# EAGLE design Rotary Encoder Breakout (EAGLE 7.7.0)
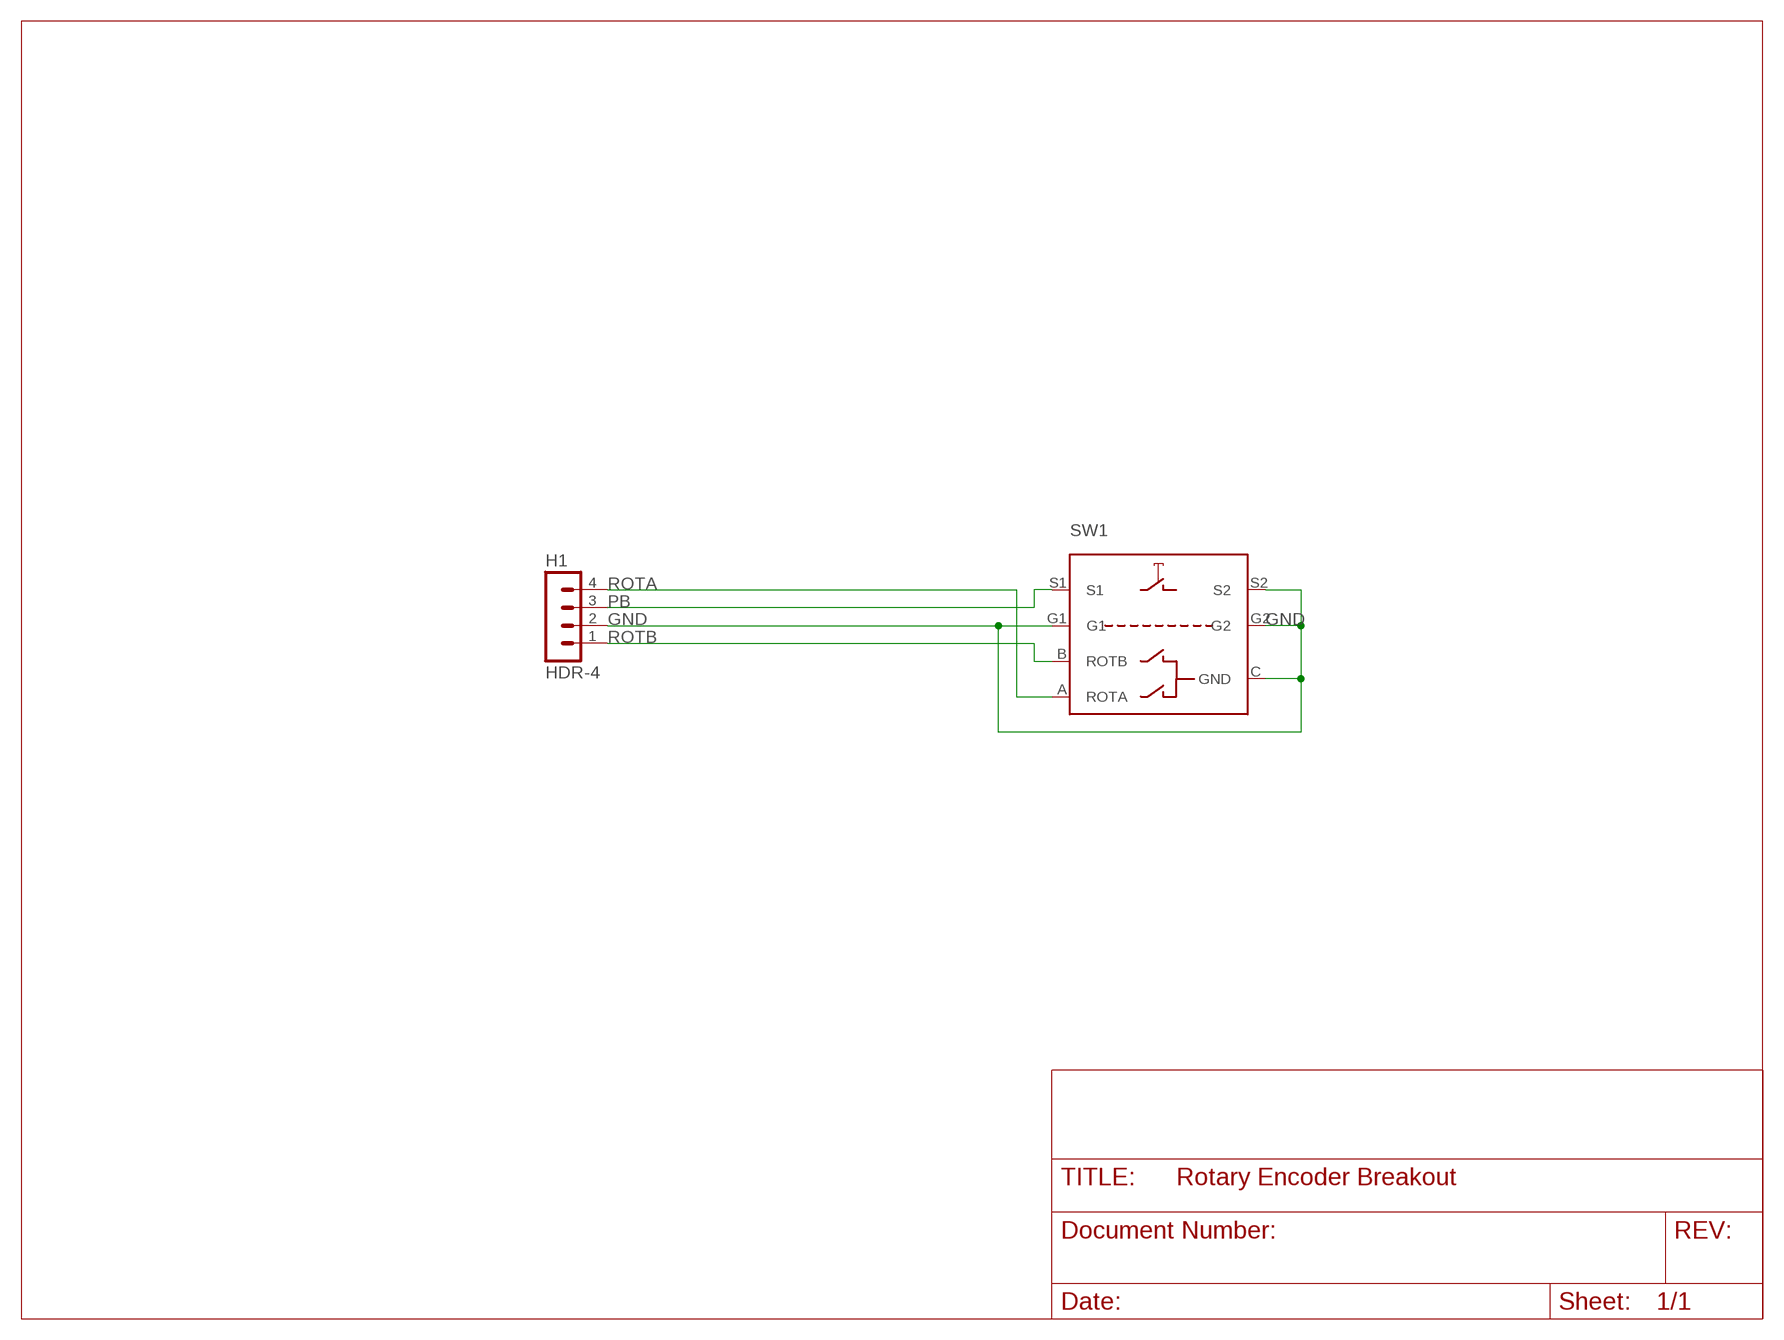
[diagram p0: schematic, sheet 1]

## Parts
H1  HDR-4  [HDR-4_VERT]
SW1  ACZ11VERTICAL  [ACZ11BRXE]

## Nets
GND: H1.2 SW1.C(GND) SW1.G1 SW1.G2 SW1.S2
PB: H1.3 SW1.S1
ROTA: H1.4 SW1.A(ROTA)
ROTB: H1.1 SW1.B(ROTB)

## Library data of the parts
H1 = Donnie:HDR-4: PIN HEADER
SW1 = LBussy:ACZ11: ACZ11: <https://www.mouser.com/datasheet/2/670/acz11-1308373.pdf> Mechanical Incremental Encoder

## Board
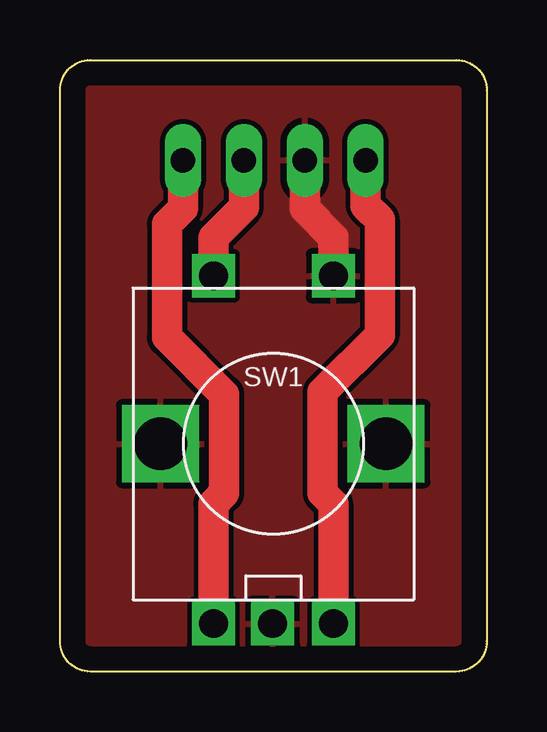
[diagram p1: board, top side]
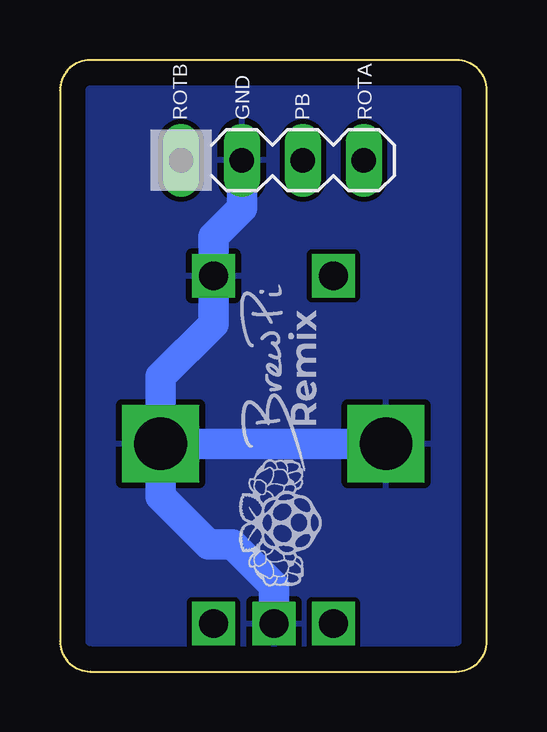
[diagram p2: board, bottom side, seen from below]

Size 17.8 x 25.5 mm. Coordinates in mm from the lower left corner, seen from the top.
Outline: 16.53,0 1.27,0 arc-90 0,1.27 0,24.23 arc-90 1.27,25.5 16.53,25.5 arc-90 17.8,24.23 17.8,1.27 arc-90 16.53,0
Copper layers 1*16: Top 0.035mm / dielectric 1.5mm / Bottom 0.035mm
Design rules "default *": minimum track width 6mil, minimum drill 0.35mm, track to track 8mil, track to pad 8mil, pad to pad 8mil, via to via 8mil, smd to smd 8mil, copper to edge 40mil, drill to drill 8mil, minimum pad ring 10mil, minimum via ring 8mil, stop-mask expansion 4mil, vias tented up to drill 0mil, thermal gap 10mil

### Footprints (pad centres in the part's own frame; a part is rotated, then mirrored left to right if it is on the bottom)
HDR-4_VERT = drill 1.016 long: 1 0,0; 2 2.54,0; 3 5.08,0; 4 7.62,0
ACZ11BRXE = drill 1.2 square: A -2.5,-7.5; B 2.5,-7.5; C -0.03,-7.5; S1 -2.5,7; S2 2.5,7 | drill 2.2 square: G1 -4.7,0; G2 4.7,0

### Placement (x,y rotation side)
H1  12.75,21.31 0 bottom
SW1  8.9,9.5 0 top

### Tracks (layer width: path | path; a pad name or v marks a point on that pad's centre or on a via)
GND
  Top 1.27: SW1.S2 11.4,18.1 10.21,19.29 H1.2
  Bottom 1.27: SW1.C 8.87,3.57 10.6,5.3 11.6,5.3 13.6,7.3 SW1.G2 | SW1.G2 13.6,12.3 11.4,14.5 SW1.S2 11.4,18.13 10.21,19.32 H1.2 | SW1.G1 SW1.G2
  pour Bottom: 18.12,-0.17 18.08,-0.2 -0.29,-0.2 -0.32,-0.23 -0.32,25.58 -0.36,25.62 18.05,25.62
  pour Top: -0.36,25.62 -0.36,-0.17 18.12,-0.17 18.12,25.62 -0.26,25.62 -0.32,25.55
PB
  Top 1.27: SW1.S1 6.4,18.1 7.67,19.37 H1.3
ROTA
  Top 1.27: H1.4 5.13,19.32 4.46,18.65 4.46,13.94 6.85,11.55 6.85,7.45 6.4,7 SW1.A
ROTB
  Top 1.27: H1.1 12.75,19.44 13.34,18.85 13.34,14.04 10.95,11.65 10.95,7.45 11.4,7 SW1.B

### Text on the board
bNames: ROTA | PB | GND | ROTB